# Altium schematic sheet Cell Balancing.SchDoc
size A4; SheetNumber: 4; SheetTotal: 8
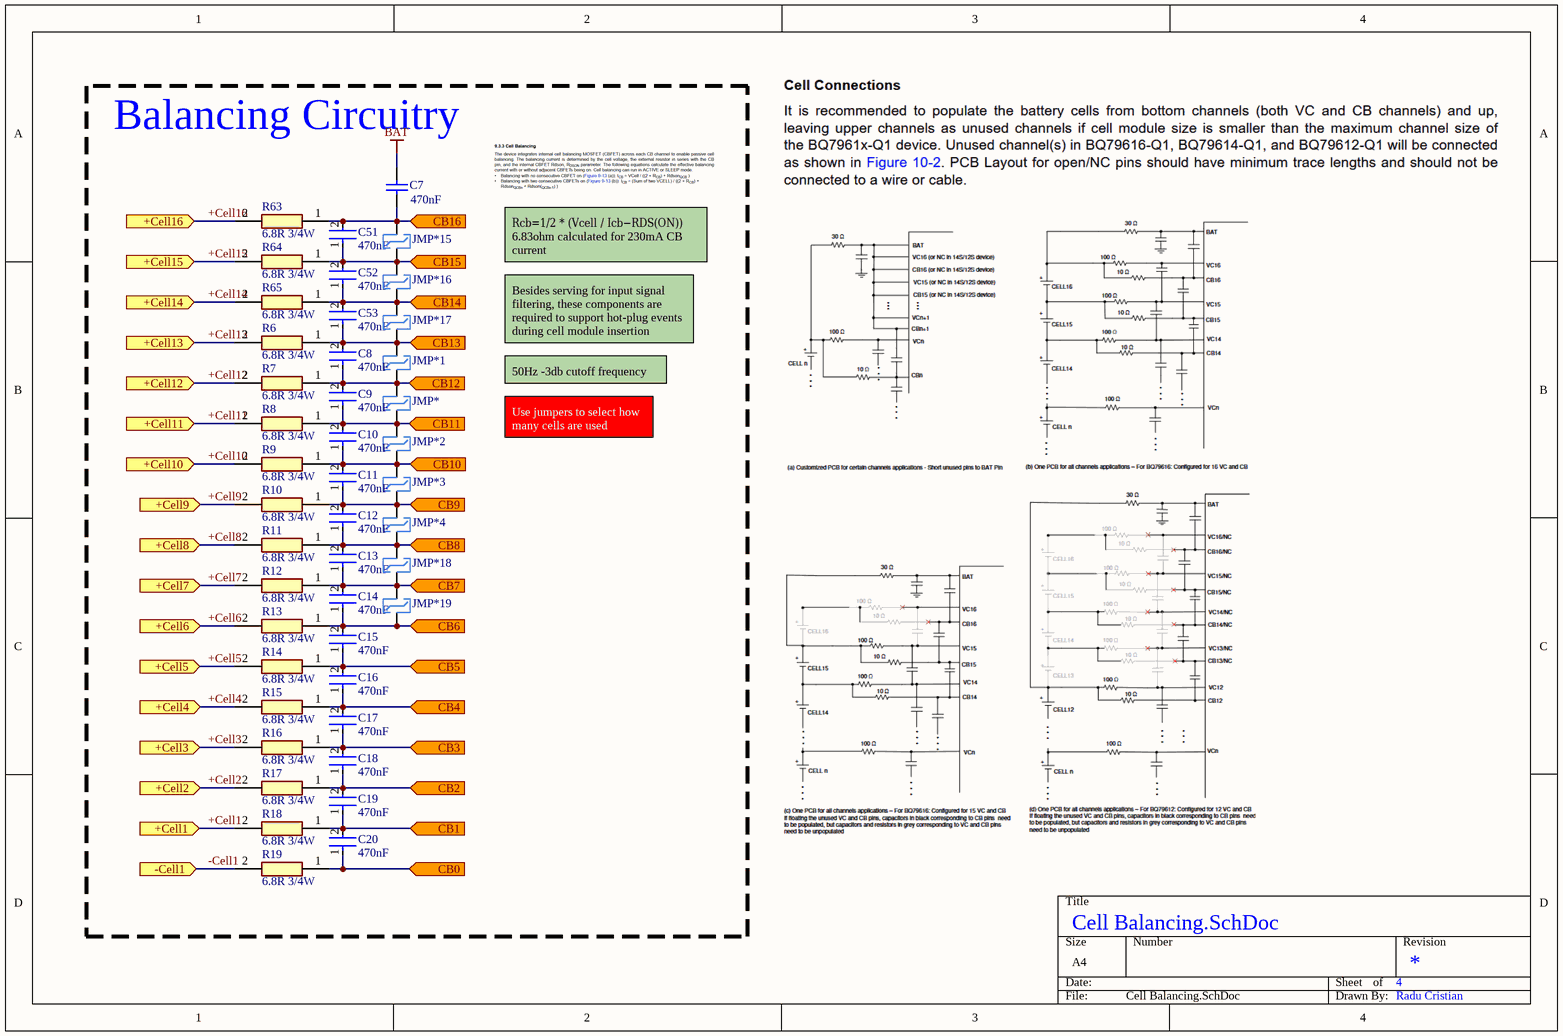
[diagram p0: Cell Balancing.SchDoc]

## Parts
C7  value 470nF  [CAPC0603(1608)100_N]  (hidden comment: CAP 470nF 25V 0603(1608))
C8  Capacitance: 470nF  [FP-0805-L_2_01_0_2-W_1_25-IPC_C]  (hidden comment: 08055C474J4Z2A)
C9  Capacitance: 470nF  [FP-0805-L_2_01_0_2-W_1_25-IPC_C]  (hidden comment: 08055C474J4Z2A)
C10  Capacitance: 470nF  [FP-0805-L_2_01_0_2-W_1_25-IPC_C]  (hidden comment: 08055C474J4Z2A)
C11  Capacitance: 470nF  [FP-0805-L_2_01_0_2-W_1_25-IPC_C]  (hidden comment: 08055C474J4Z2A)
C12  Capacitance: 470nF  [FP-0805-L_2_01_0_2-W_1_25-IPC_C]  (hidden comment: 08055C474J4Z2A)
C13  Capacitance: 470nF  [FP-0805-L_2_01_0_2-W_1_25-IPC_C]  (hidden comment: 08055C474J4Z2A)
C14  Capacitance: 470nF  [FP-0805-L_2_01_0_2-W_1_25-IPC_C]  (hidden comment: 08055C474J4Z2A)
C15  Capacitance: 470nF  [FP-0805-L_2_01_0_2-W_1_25-IPC_C]  (hidden comment: 08055C474J4Z2A)
C16  Capacitance: 470nF  [FP-0805-L_2_01_0_2-W_1_25-IPC_C]  (hidden comment: 08055C474J4Z2A)
C17  Capacitance: 470nF  [FP-0805-L_2_01_0_2-W_1_25-IPC_C]  (hidden comment: 08055C474J4Z2A)
C18  Capacitance: 470nF  [FP-0805-L_2_01_0_2-W_1_25-IPC_C]  (hidden comment: 08055C474J4Z2A)
C19  Capacitance: 470nF  [FP-0805-L_2_01_0_2-W_1_25-IPC_C]  (hidden comment: 08055C474J4Z2A)
C20  Capacitance: 470nF  [FP-0805-L_2_01_0_2-W_1_25-IPC_C]  (hidden comment: 08055C474J4Z2A)
C51  Capacitance: 470nF  [FP-0805-L_2_01_0_2-W_1_25-IPC_C]  (hidden comment: 08055C474J4Z2A)
C52  Capacitance: 470nF  [FP-0805-L_2_01_0_2-W_1_25-IPC_C]  (hidden comment: 08055C474J4Z2A)
C53  Capacitance: 470nF  [FP-0805-L_2_01_0_2-W_1_25-IPC_C]  (hidden comment: 08055C474J4Z2A)
JMP*  Solder Jumper  [Solder Jumper-Footprint-1]  (value not drawn)
JMP*1  Solder Jumper  [Solder Jumper-Footprint-1]  (value not drawn)
JMP*2  Solder Jumper  [Solder Jumper-Footprint-1]  (value not drawn)
JMP*3  Solder Jumper  [Solder Jumper-Footprint-1]  (value not drawn)
JMP*4  Solder Jumper  [Solder Jumper-Footprint-1]  (value not drawn)
JMP*15  Solder Jumper  [Solder Jumper-Footprint-1]  (value not drawn)
JMP*16  Solder Jumper  [Solder Jumper-Footprint-1]  (value not drawn)
JMP*17  Solder Jumper  [Solder Jumper-Footprint-1]  (value not drawn)
JMP*18  Solder Jumper  [Solder Jumper-Footprint-1]  (value not drawn)
JMP*19  Solder Jumper  [Solder Jumper-Footprint-1]  (value not drawn)
R6  Parameter 1: 6.8R 3/4W  [RESC3116X65N]  (hidden comment: CRCW12066R80JNEAHP)
R7  Parameter 1: 6.8R 3/4W  [RESC3116X65N]  (hidden comment: CRCW12066R80JNEAHP)
R8  Parameter 1: 6.8R 3/4W  [RESC3116X65N]  (hidden comment: CRCW12066R80JNEAHP)
R9  Parameter 1: 6.8R 3/4W  [RESC3116X65N]  (hidden comment: CRCW12066R80JNEAHP)
R10  Parameter 1: 6.8R 3/4W  [RESC3116X65N]  (hidden comment: CRCW12066R80JNEAHP)
R11  Parameter 1: 6.8R 3/4W  [RESC3116X65N]  (hidden comment: CRCW12066R80JNEAHP)
R12  Parameter 1: 6.8R 3/4W  [RESC3116X65N]  (hidden comment: CRCW12066R80JNEAHP)
R13  Parameter 1: 6.8R 3/4W  [RESC3116X65N]  (hidden comment: CRCW12066R80JNEAHP)
R14  Parameter 1: 6.8R 3/4W  [RESC3116X65N]  (hidden comment: CRCW12066R80JNEAHP)
R15  Parameter 1: 6.8R 3/4W  [RESC3116X65N]  (hidden comment: CRCW12066R80JNEAHP)
R16  Parameter 1: 6.8R 3/4W  [RESC3116X65N]  (hidden comment: CRCW12066R80JNEAHP)
R17  Parameter 1: 6.8R 3/4W  [RESC3116X65N]  (hidden comment: CRCW12066R80JNEAHP)
R18  Parameter 1: 6.8R 3/4W  [RESC3116X65N]  (hidden comment: CRCW12066R80JNEAHP)
R19  Parameter 1: 6.8R 3/4W  [RESC3116X65N]  (hidden comment: CRCW12066R80JNEAHP)
R63  Parameter 1: 6.8R 3/4W  [RESC3116X65N]  (hidden comment: CRCW12066R80JNEAHP)
R64  Parameter 1: 6.8R 3/4W  [RESC3116X65N]  (hidden comment: CRCW12066R80JNEAHP)
R65  Parameter 1: 6.8R 3/4W  [RESC3116X65N]  (hidden comment: CRCW12066R80JNEAHP)

## Blocks framed on the sheet
Balancing Circuitry: C7-C20 C51-C53 JMP* JMP*1-JMP*4 JMP*15-JMP*19 R6-R19 R63-R65

## Ports
+Cell1 (in, see Cell Voltage Sensing[1D], Connectors[1A]), +Cell2 (in, see Cell Voltage Sensing[1D], Connectors[1B]), +Cell3 (in, see Cell Voltage Sensing[1D], Connectors[1B]), +Cell4 (in, see Cell Voltage Sensing[1C], Connectors[1B]), +Cell5 (in, see Cell Voltage Sensing[1C], Connectors[1B]), +Cell6 (in, see Cell Voltage Sensing[1C], Connectors[1B]), +Cell7 (in, see Cell Voltage Sensing[1C], Connectors[2A]), +Cell8 (in, see Cell Voltage Sensing[1C], Connectors[2A]), +Cell9 (in, see Cell Voltage Sensing[1C], Connectors[2A]), +Cell10 (in, see Cell Voltage Sensing[1B], Connectors[2B]), +Cell11 (in, see Cell Voltage Sensing[1B], Connectors[2B]), +Cell12 (in, see Cell Voltage Sensing[1B], Connectors[2B]), +Cell13 (in, see Cell Voltage Sensing[1B], Connectors[2B]), +Cell14 (in, see Cell Voltage Sensing[1B], Connectors[2B]), +Cell15 (in, see Cell Voltage Sensing[1B], Connectors[2B]), +Cell16 (in, see Cell Voltage Sensing[1B], Connectors[2B]), -Cell1 (in, see Cell Voltage Sensing[1D], Connectors[1A]), CB0 (in, see BQ chip[2C]), CB1 (in, see BQ chip[2D]), CB2 (in, see BQ chip[2D]), CB3 (in, see BQ chip[2D]), CB4 (in, see BQ chip[2D]), CB5 (in, see BQ chip[2D]), CB6 (in, see BQ chip[2D]), CB7 (in, see BQ chip[2D]), CB8 (in, see BQ chip[2D]), CB9 (in, see BQ chip[1C]), CB10 (in, see BQ chip[1C]), CB11 (in, see BQ chip[1C]), CB12 (in, see BQ chip[1C]), CB13 (in, see BQ chip[1B]), CB14 (in, see BQ chip[1B]), CB15 (in, see BQ chip[1B]), CB16 (in, see BQ chip[1B])

## Nets
BAT: C7.2
+Cell1: R18.2 ; port +Cell1
+Cell2: R17.2 ; port +Cell2
+Cell3: R16.2 ; port +Cell3
+Cell4: R15.2 ; port +Cell4
+Cell5: R14.2 ; port +Cell5
+Cell6: R13.2 ; port +Cell6
+Cell7: R12.2 ; port +Cell7
+Cell8: R11.2 ; port +Cell8
+Cell9: R10.2 ; port +Cell9
+Cell10: R9.2 ; port +Cell10
+Cell11: R8.2 ; port +Cell11
+Cell12: R7.2 ; port +Cell12
+Cell13: R6.2 ; port +Cell13
+Cell14: R65.2 ; port +Cell14
+Cell15: R64.2 ; port +Cell15
+Cell16: R63.2 ; port +Cell16
-Cell1: R19.2 ; port -Cell1
CB0: C20.1 R19.1 ; port CB0
CB1: C19.1 C20.2 R18.1 ; port CB1
CB2: C18.1 C19.2 R17.1 ; port CB2
CB3: C17.1 C18.2 R16.1 ; port CB3
CB4: C16.1 C17.2 R15.1 ; port CB4
CB5: C15.1 C16.2 R14.1 ; port CB5
CB6: C14.1 C15.2 JMP*19.1 R13.1 ; port CB6
CB7: C13.1 C14.2 JMP*18.1 JMP*19.2 R12.1 ; port CB7
CB8: C12.1 C13.2 JMP*4.1 JMP*18.2 R11.1 ; port CB8
CB9: C11.1 C12.2 JMP*3.1 JMP*4.2 R10.1 ; port CB9
CB10: C10.1 C11.2 JMP*2.1 JMP*3.2 R9.1 ; port CB10
CB11: C9.1 C10.2 JMP*.1 JMP*2.2 R8.1 ; port CB11
CB12: C8.1 C9.2 JMP*.2 JMP*1.1 R7.1 ; port CB12
CB13: C8.2 C53.1 JMP*1.2 JMP*17.1 R6.1 ; port CB13
CB14: C52.1 C53.2 JMP*16.1 JMP*17.2 R65.1 ; port CB14
CB15: C51.1 C52.2 JMP*15.1 JMP*16.2 R64.1 ; port CB15
CB16: C7.1 C51.2 JMP*15.2 R63.1 ; port CB16

## Notes on the sheet
- Rcb=1/2 * ​(Vcell / Icb​​−RDS(ON)​)
  6.83ohm calculated for 230mA CB current
- 50Hz -3db cutoff frequency
- Besides serving for input signal filtering, these components are required to support hot-plug events during cell module insertion
- Use jumpers to select how many cells are used
- Radu Cristian

## Library data of the parts
C7 = CMP-1035-02704-1: CAP 470nF 25V ±20% 0603 (1608 Metric) Thickness 1mm SMD; Case-Metric: 1608; Case-EIA: 0603; Tolerance: Â±20%; Technology: SMT; Rated Voltage: 25 V; Max Thickness: 1 mm
C8-C20 C51-C53 = CMP-04427-003155-1: Automotive Ceramic Capacitor, 0805, 470nF, 5%, X7R, 15%, 50V; Dielectric: X7R; Depth: 1.25mm; Max Operating Temperature: 125°C; Mount: Surface Mount; Radiation Hardening: No; Construction: Flat; Packaging: Tape and Reel; Min Operating Temperature: -55°C; Length: 2.01mm; RoHS Compliant: Yes; Voltage Rating (DC): 50V; Case/Package: 0805; Tolerance: 5%; Package Quantity: 2000
JMP* JMP*1-JMP*4 JMP*15-JMP*19 = CMP-00000-3: 2 port solder jumper
R6-R19 R63-R65 = CRCW12066R80JNEAHP: Thick Film Resistors - SMD 3/4watt 6.8ohm 5% High Power AEC-Q200; Manufacturer_Name: Vishay; Height: 0.65mm; Manufacturer_Part_Number: CRCW12066R80JNEAHP; Supplier 1: DigiKey; Supplier Part Number 1: 541-CRCW12066R80JNEAHPCT-ND